# EAGLE design SixPotatoeV5 (EAGLE 9.6.0)
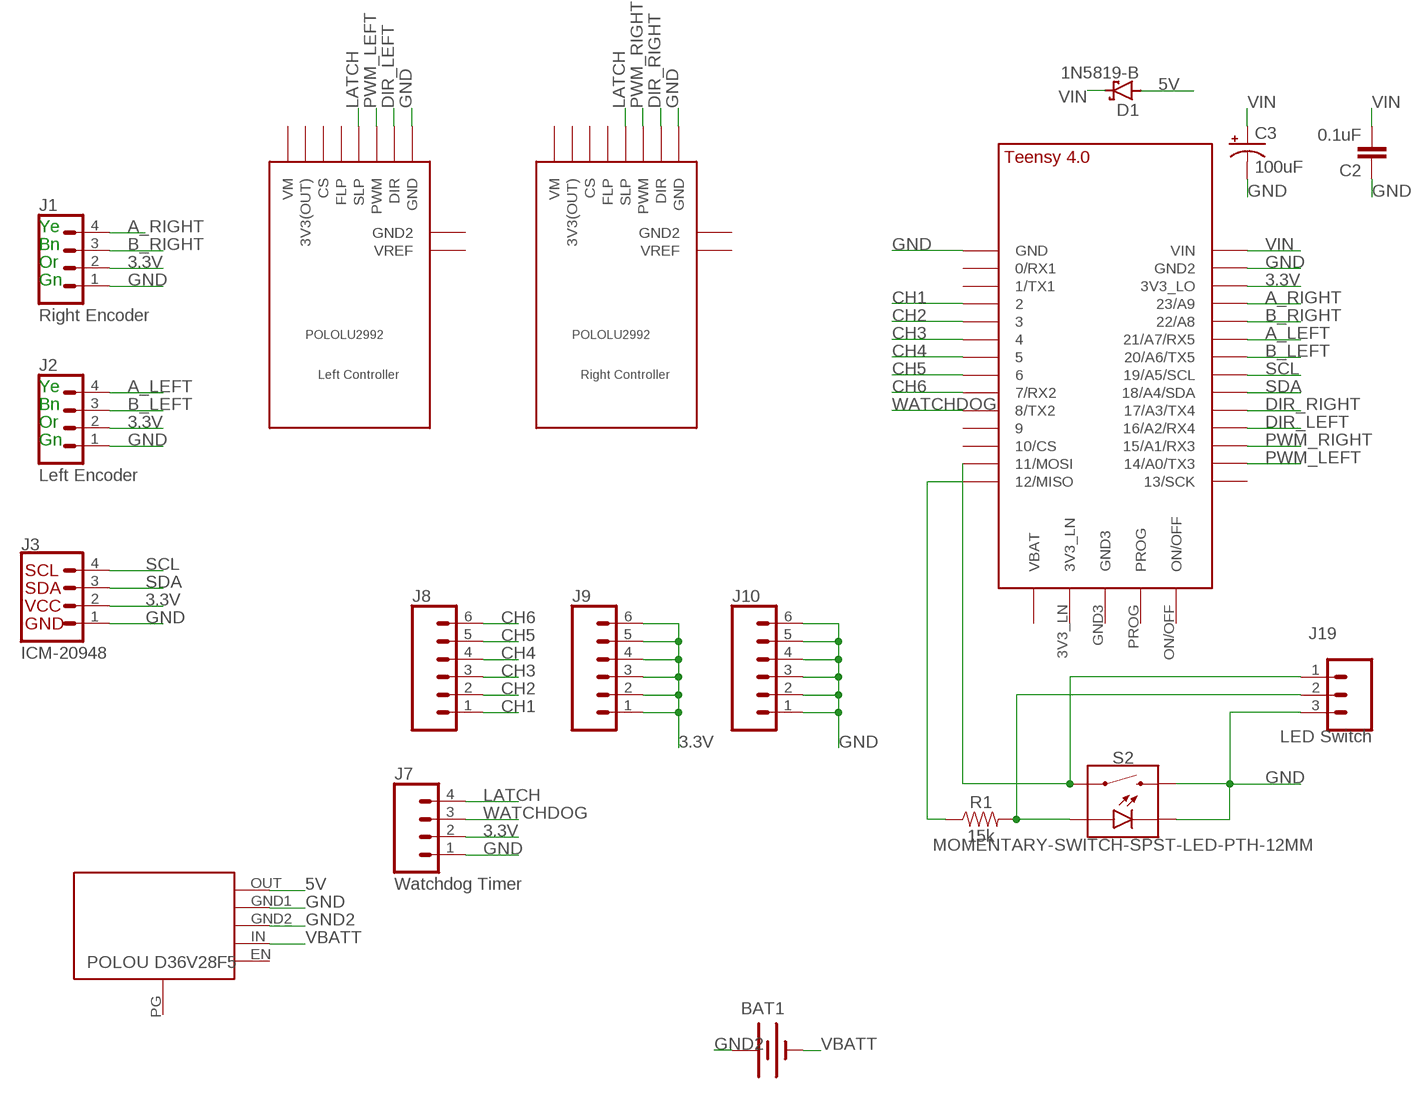
[diagram p0: schematic, sheet 1]

## Parts
BAT1  XT60_MALE  [XT60]
C2  0.1uF  0.1UF-KIT-EZ-50V-20%  [CAP-PTH-SMALL-KIT]
C3  100uF  100UF-POLAR-RADIAL-2.5MM-25V-20%  [CPOL-RADIAL-2.5MM-6.5MM]
D1  1N5819-B  [DO41-7.6]
J1  CONN_04  [1X04]
J2  CONN_04  [1X04]
J3  I2C_STANDARD  [1X04]
J7  CONN_04  [1X04]
J8  CONN_06NO_SILK_FEMALE_PTH  [1X06_NO_SILK]
J9  CONN_06NO_SILK_FEMALE_PTH  [1X06_NO_SILK]
J10  CONN_06NO_SILK_FEMALE_PTH  [1X06_NO_SILK]
J19  CONN_03  [1X03]
R1  15k  15KOHM-HORIZ-1/4W-5%  [AXIAL-0.3]
S2  MOMENTARY-SWITCH-SPST-LED-PTH-12MM  [TACTILE_SWITCH_LED_PTH_12MM]
U$1  TEENSY_4.0  [TEENSY_4.0]
U$2  Left Controller  POLOLU2992_2  [POLOLU2992_2]
U$3  Right Controller  POLOLU2992_2  [POLOLU2992_2]
U$4  POLOU3782  [POLOU3782]

## Nets
3.3V: J1.2 J2.2 J3.2 J7.2 J9.1 J9.2 J9.3 J9.4 J9.5 J9.6 U$1.3V3_LO
5V: D1.A U$4.OUT
A_LEFT: J2.4 U$1.21/A7(21/A7/RX5)
A_RIGHT: J1.4 U$1.23/A9
B_LEFT: J2.3 U$1.20/A6(20/A6/TX5)
B_RIGHT: J1.3 U$1.22/A8
CH1: J8.1 U$1.2
CH2: J8.2 U$1.3/CANTX
CH3: J8.3 U$1.4/CANRX
CH4: J8.4 U$1.5
CH5: J8.5 U$1.6
CH6: J8.6 U$1.7(7/RX2)
DIR_LEFT: U$1.16/A2(16/A2/RX4) U$2.DIR
DIR_RIGHT: U$1.17/A3(17/A3/TX4) U$3.DIR
GND: C2.1 C3.2(-) J1.1 J2.1 J3.1 J7.1 J10.1 J10.2 J10.3 J10.4 J10.5 J10.6 J19.3 S2.2 S2.C U$1.GND U$1.GND2 U$2.GND U$3.GND U$4.GND1
GND2: BAT1.+ U$4.GND2
LATCH: J7.4 U$2.SLP U$3.SLP
N$2: J19.2 R1.P$2 S2.A
N$3: R1.P$1 U$1.12/MISO
N$4: J19.1 S2.4 U$1.11/MOSI
PWM_LEFT: U$1.14/A0(14/A0/TX3) U$2.PWM
PWM_RIGHT: U$1.15/A1(15/A1/RX3) U$3.PWM
SCL: J3.4 U$1.19/A5/SCL
SDA: J3.3 U$1.18/A4/SDA
VBATT: BAT1.- U$4.IN
VIN: C2.2 C3.1(+) D1.C U$1.VIN
WATCHDOG: J7.3 U$1.8(8/TX2)
Unconnected: U$1.0/RX(0/RX1) U$1.1/TX(1/TX1) U$1.3V3_LN U$1.9/CS U$1.10/CS U$1.13/SCK U$1.GND3 U$1.ON/OFF U$1.PROG U$1.VBAT\(VBAT) U$2.3V3(OUT) U$2.CS U$2.FLP U$2.GND2 U$2.VM U$2.VREF U$3.3V3(OUT) U$3.CS U$3.FLP U$3.GND2 U$3.VM U$3.VREF U$4.EN U$4.PG

## Notes on the sheet
- Ye
- Bn
- Or
- Gn
- Ye
- Bn
- Or
- Gn

## Library data of the parts
BAT1 = Tristan+Robitaille's+Library:XT60_MALE: Vertical Mount Through-Hole Male (for female battery) XT60 Connector
C2 = SparkFun-Capacitors:0.1UF: 0.1µF ceramic capacitors A capacitor is a passive two-terminal electrical component used to store electrical energy temporarily in an electric field.; PROD_ID: CAP-08370
C3 = SparkFun-Capacitors:100UF-POLAR: 100µF polarized capacitors A capacitor is a passive two-terminal electrical component used to store electrical energy temporarily in an electric field.; PROD_ID: CAP-08439
D1 = diode:1N581*: 1.0A SCHOTTKY BARRIER RECTIFIER Source: http://www.diodes.com/datasheets/ds23001.pdf
J1 = SparkFun-Connectors:CONN_04: Multi connection point. Often used as Generic Header-pin footprint for 0.1 inch spaced/style header connections On any of the 0.1 inch spaced packages, you can populate with these: Break Away Headers - Straight <https://www.sparkfun.com/products/116> (PRT-00116) Break Away Male Headers - Right Angle <https://www.sparkfun.com/products/553> (PRT-00553) Female Headers <https://www.sparkfun.com/products/115> (PRT-00115) Break Away Headers - Machine Pin <https://www.sparkfun.com/products/117> (PRT-00117) Break Away Female Headers - Swiss Machine Pin <https://www.sparkfun.com/products/743> (PRT-00743) For SCREWTERMINALS and SPRING TERMINALS visit here: Screw Terimnals on SparkFun.com <https://www.sparkfun.com/search/results?term=Screw+Terminals> (5mm/3.5mm/2.54mm spacing) This device is also useful as a general connection point to wire up your design to another part of your project. Our various solder wires solder well into these plated through hole pads. Hook-Up Wire - Assortment (Stranded, 22 AWG) <https://www.sparkfun.com/products/11375> (PRT-11375) Hook-Up Wire - Assortment (Solid Core, 22 AWG) <https://www.sparkfun.com/products/11367> (PRT-11367) View the entire wire category on our website here <https://www.sparkfun.com/categories/141> Special notes: Molex polarized connector foot print use with SKU : PRT-08231 with associated crimp pins and housings. 1MM SMD Version SKU: PRT-10208; ID: Right Encoder; PROD_ID: CONN-09696
J2 = SparkFun-Connectors:CONN_04: Multi connection point. Often used as Generic Header-pin footprint for 0.1 inch spaced/style header connections On any of the 0.1 inch spaced packages, you can populate with these: Break Away Headers - Straight <https://www.sparkfun.com/products/116> (PRT-00116) Break Away Male Headers - Right Angle <https://www.sparkfun.com/products/553> (PRT-00553) Female Headers <https://www.sparkfun.com/products/115> (PRT-00115) Break Away Headers - Machine Pin <https://www.sparkfun.com/products/117> (PRT-00117) Break Away Female Headers - Swiss Machine Pin <https://www.sparkfun.com/products/743> (PRT-00743) For SCREWTERMINALS and SPRING TERMINALS visit here: Screw Terimnals on SparkFun.com <https://www.sparkfun.com/search/results?term=Screw+Terminals> (5mm/3.5mm/2.54mm spacing) This device is also useful as a general connection point to wire up your design to another part of your project. Our various solder wires solder well into these plated through hole pads. Hook-Up Wire - Assortment (Stranded, 22 AWG) <https://www.sparkfun.com/products/11375> (PRT-11375) Hook-Up Wire - Assortment (Solid Core, 22 AWG) <https://www.sparkfun.com/products/11367> (PRT-11367) View the entire wire category on our website here <https://www.sparkfun.com/categories/141> Special notes: Molex polarized connector foot print use with SKU : PRT-08231 with associated crimp pins and housings. 1MM SMD Version SKU: PRT-10208; ID: Left Encoder; PROD_ID: CONN-09696
J3 = SparkFun-Connectors:I2C_STANDARD: SparkFun I2C Standard Pinout Header SparkFun has standardized on a pinout for all I2C based sensor breakouts. This pinout allows I2C boards to be plugged directly into the headers on Arduino Uno compatible boards, and to be daisy chained easily. Example SparkFun Products: SparkFun Atmospheric Sensor Breakout - BME280 <https://www.sparkfun.com/products/13676> SparkFun Altitude/Pressure Sensor Breakout - MPL3115A2 <https://www.sparkfun.com/products/11084> SparkFun TOF Range Finder Sensor - VL6180 <https://www.sparkfun.com/products/12785>; ID: ICM-20948
J7 = SparkFun-Connectors:CONN_04: Multi connection point. Often used as Generic Header-pin footprint for 0.1 inch spaced/style header connections On any of the 0.1 inch spaced packages, you can populate with these: Break Away Headers - Straight <https://www.sparkfun.com/products/116> (PRT-00116) Break Away Male Headers - Right Angle <https://www.sparkfun.com/products/553> (PRT-00553) Female Headers <https://www.sparkfun.com/products/115> (PRT-00115) Break Away Headers - Machine Pin <https://www.sparkfun.com/products/117> (PRT-00117) Break Away Female Headers - Swiss Machine Pin <https://www.sparkfun.com/products/743> (PRT-00743) For SCREWTERMINALS and SPRING TERMINALS visit here: Screw Terimnals on SparkFun.com <https://www.sparkfun.com/search/results?term=Screw+Terminals> (5mm/3.5mm/2.54mm spacing) This device is also useful as a general connection point to wire up your design to another part of your project. Our various solder wires solder well into these plated through hole pads. Hook-Up Wire - Assortment (Stranded, 22 AWG) <https://www.sparkfun.com/products/11375> (PRT-11375) Hook-Up Wire - Assortment (Solid Core, 22 AWG) <https://www.sparkfun.com/products/11367> (PRT-11367) View the entire wire category on our website here <https://www.sparkfun.com/categories/141> Special notes: Molex polarized connector foot print use with SKU : PRT-08231 with associated crimp pins and housings. 1MM SMD Version SKU: PRT-10208; ID: Watchdog Timer; PROD_ID: CONN-09696
J8-J10 = SparkFun-Connectors:CONN_06: Multi connection point. Often used as Generic Header-pin footprint for 0.1 inch spaced/style header connections On any of the 0.1 inch spaced packages, you can populate with these: Break Away Headers - Straight <https://www.sparkfun.com/products/116> (PRT-00116) Break Away Male Headers - Right Angle <https://www.sparkfun.com/products/553> (PRT-00553) Female Headers <https://www.sparkfun.com/products/115> (PRT-00115) Break Away Headers - Machine Pin <https://www.sparkfun.com/products/117> (PRT-00117) Break Away Female Headers - Swiss Machine Pin <https://www.sparkfun.com/products/743> (PRT-00743) Arduino Stackable Header - 6 Pin <https://www.sparkfun.com/products/9280> (PRT-09280) For SCREWTERMINALS and SPRING TERMINALS visit here: Screw Terimnals on SparkFun.com <https://www.sparkfun.com/search/results?term=Screw+Terminals> (5mm/3.5mm/2.54mm spacing) This device is also useful as a general connection point to wire up your design to another part of your project. Our various solder wires solder well into these plated through hole pads. Hook-Up Wire - Assortment (Stranded, 22 AWG) <https://www.sparkfun.com/products/11375> (PRT-11375) Hook-Up Wire - Assortment (Solid Core, 22 AWG) <https://www.sparkfun.com/products/11367> (PRT-11367) View the entire wire category on our website here <https://www.sparkfun.com/categories/141>; PROD_ID: CONN-08437
J19 = SparkFun-Connectors:CONN_03: Multi connection point. Often used as Generic Header-pin footprint for 0.1 inch spaced/style header connections On any of the 0.1 inch spaced packages, you can populate with these: Break Away Headers - Straight <https://www.sparkfun.com/products/116> (PRT-00116) Break Away Male Headers - Right Angle <https://www.sparkfun.com/products/553> (PRT-00553) Female Headers <https://www.sparkfun.com/products/115> (PRT-00115) Break Away Headers - Machine Pin <https://www.sparkfun.com/products/117> (PRT-00117) Break Away Female Headers - Swiss Machine Pin <https://www.sparkfun.com/products/743> (PRT-00743) Stackable Header - 3 Pin (Female, 0.1") <https://www.sparkfun.com/products/13875> (PRT-13875) For SCREWTERMINALS and SPRING TERMINALS visit here: Screw Terimnals on SparkFun.com <https://www.sparkfun.com/search/results?term=Screw+Terminals> (5mm/3.5mm/2.54mm spacing) This device is also useful as a general connection point to wire up your design to another part of your project. Our various solder wires solder well into these plated through hole pads. Hook-Up Wire - Assortment (Stranded, 22 AWG) <https://www.sparkfun.com/products/11375> (PRT-11375) Hook-Up Wire - Assortment (Solid Core, 22 AWG) <https://www.sparkfun.com/products/11367> (PRT-11367) View the entire wire category on our website here <https://www.sparkfun.com/categories/141> Special notes: Molex polarized connector foot print use with SKU : PRT-08232 with associated crimp pins and housings.; ID: LED Switch
R1 = SparkFun-Resistors:15KOHM: 15kΩ resistor A resistor is a passive two-terminal electrical component that implements electrical resistance as a circuit element. Resistors act to reduce current flow, and, at the same time, act to lower voltage levels within circuits. - Wikipedia; PROD_ID: RES-11360
S2 = TimEagleLibrary:MOMENTARY-SWITCH-SPST-LED: Momentary Switch (Pushbutton) - SPST - w/ LED Normally-open (NO) SPST momentary switches (buttons, pushbuttons), with a built-in LED. Variants PTH-CHERRY - Cherry MX Switch Cherry MX Keyswitches are top-of-the-line mechanical keyboard switches. They’re satisfyingly “clicky”, reliable up to tens-of-millions of key presses, and a standard in gaming and programming keyboards across the globe. This ‘blue’ version Cherry MX Switch is favored by most due to its secondary internal actuator making it less likely to “double-tap.” If you are looking for a noticeably audible and high-quality key switch, this is the perfect option for you! Cherry MX Switch <https://www.sparkfun.com/products/13834> (COM-13834) Cherry MX Switch Breakout <https://www.sparkfun.com/products/13773> (BOB-13773) PTH-12MM and PTH-12MM-KIT - 12mm Illuminated LED KIT variant is for soldering kits. There is no tStop (covering up the top side of the pads with mask). This helps the beginner see which side they should be soldering too. LED Tactile Button Breakout <https://www.sparkfun.com/products/10467> (BOB-10467) LED Tactile Button - Red <https://www.sparkfun.com/products/10442> (COM-10442) LED Tactile Button - Blue <https://www.sparkfun.com/products/10443> (COM-10443) LED Tactile Button - Green <https://www.sparkfun.com/products/10440> (COM-10440) LED Tactile Button - Orange <https://www.sparkfun.com/products/10441> (COM-10441) LED Tactile Button - White <https://www.sparkfun.com/products/10439> (COM-10439); PROD_ID: SWCH-11758; SF_SKU: COM-10442
U$1 = TEENSY 4.0:TEENSY_4.0
U$2 U$3 = TimEagleLibrary:POLOLU2992_2
U$4 = TimEagleLibrary:POLOU3782

## Board
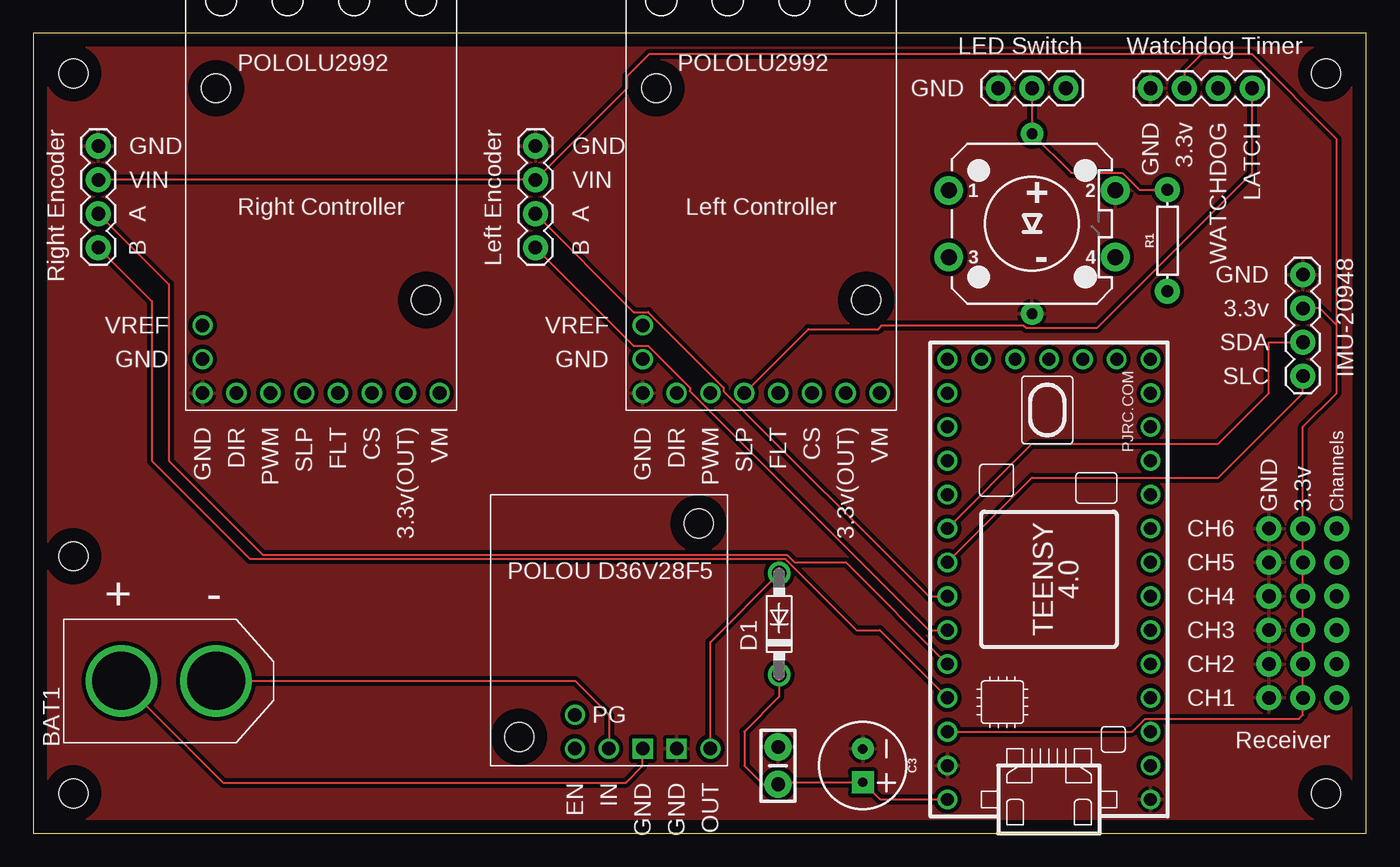
[diagram p1: board, top side]
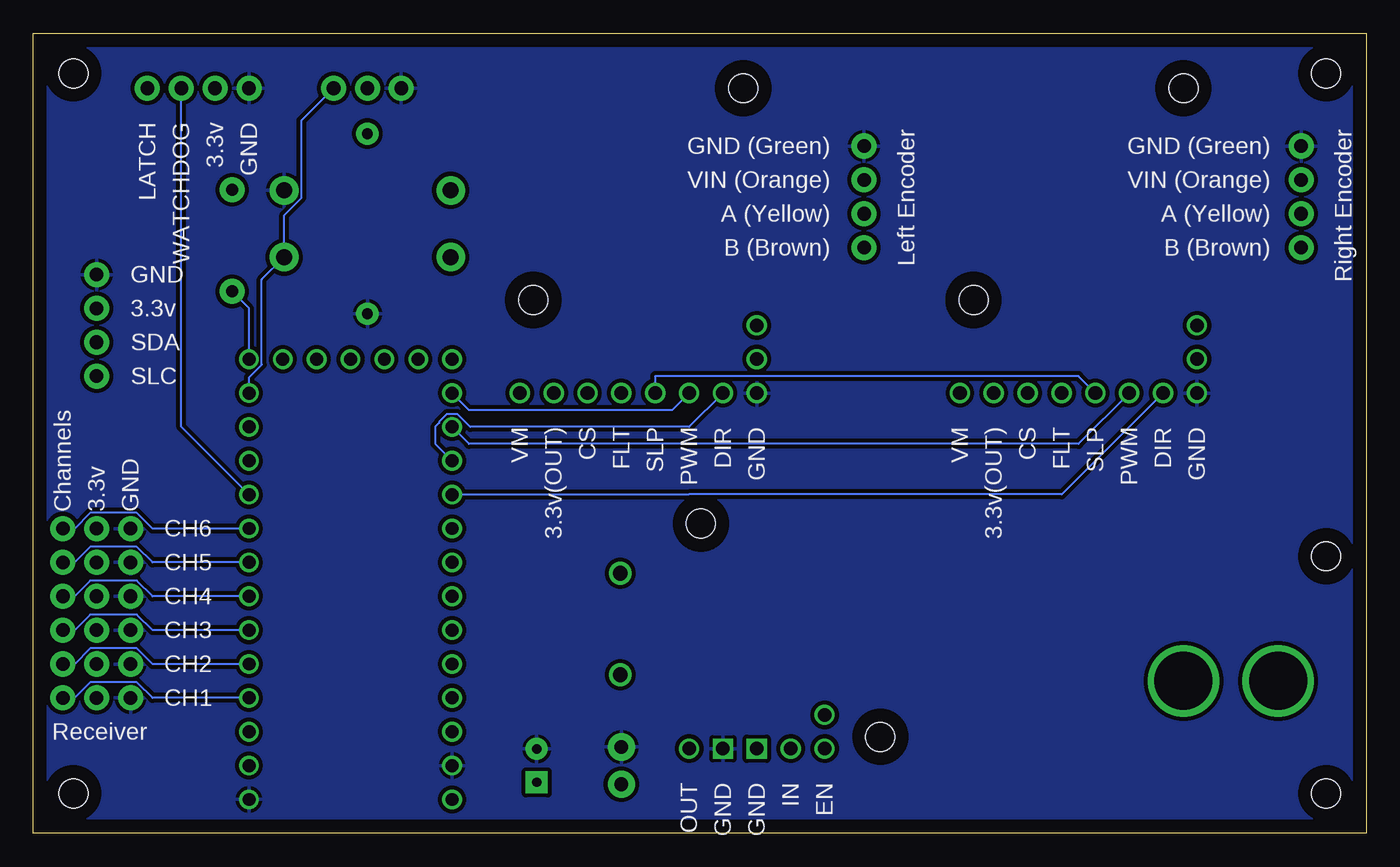
[diagram p2: board, bottom side, seen from below]

Size 100 x 60 mm. Coordinates in mm from the lower left corner, seen from the top.
Outline: 0,0 100,0 100,60 0,60 0,0
Copper layers (1*16): Top 0.035mm / dielectric 1.5mm / Bottom 0.035mm
Design rules "default": minimum track width 6mil, minimum drill 0.35mm, track to track 6mil, track to pad 6mil, pad to pad 6mil, via to via 6mil, smd to smd 6mil, copper to edge 40mil, drill to drill 6mil, minimum pad ring 10mil, minimum via ring 8mil, stop-mask expansion 4mil, vias tented up to drill 0mil, thermal gap 10mil
Holes 2.18 mm at 97,57 97,3 3,3 3,57 3,20.78

### Footprints (pad centres in the part's own frame; a part is rotated, then mirrored left to right if it is on the bottom)
XT60 = drill 4.35: + 3.55,0; - -3.55,0
CAP-PTH-SMALL-KIT = drill 1.016 pad 2.032: 1 -1.397,0; 2 1.397,0
CPOL-RADIAL-2.5MM-6.5MM = drill 0.7 pad 1.651 square: 1 1.25,0 | drill 0.7 pad 1.651: 2 -1.25,0
DO41-7.6 = drill 1.1 pad 1.7: A 3.81,0; C -3.81,0
1X04 = drill 1.016 pad 1.88: 1 0,0; 2 2.54,0; 3 5.08,0; 4 7.62,0
1X06_NO_SILK = drill 1.016 pad 1.88: 1 0,0; 2 2.54,0; 3 5.08,0; 4 7.62,0; 5 10.16,0; 6 12.7,0
1X03 = drill 1.016 pad 1.88: 1 0,0; 2 2.54,0; 3 5.08,0
AXIAL-0.3 = drill 0.9 pad 1.88: P$1 -3.81,0; P$2 3.81,0
TACTILE_SWITCH_LED_PTH_12MM = drill 1.2 pad 2.159: 1 -6.25,2.5; 2 6.25,2.5; 3 -6.25,-2.5; 4 6.25,-2.5 | drill 0.8 pad 1.676: A 0,6.75; C 0,-6.75
TEENSY_4.0 = drill 0.965: 0/RX -13.97,-7.62; 1/TX -11.43,-7.62; 2 -8.89,-7.62; 3/CANTX -6.35,-7.62; 3V3_LN 16.51,-2.54; 3V3_LO -11.43,7.62; 4/CANRX -3.81,-7.62; 5 -1.27,-7.62; 6 1.27,-7.62; 7 3.81,-7.62; 8 6.35,-7.62; 9/CS 8.89,-7.62; 10/CS 11.43,-7.62; 11/MOSI 13.97,-7.62; 12/MISO 16.51,-7.62; 13/SCK 16.51,7.62; 14/A0 13.97,7.62; 15/A1 11.43,7.62; 16/A2 8.89,7.62; 17/A3 6.35,7.62; 18/A4/SDA 3.81,7.62; 19/A5/SCL 1.27,7.62; 20/A6 -1.27,7.62; 21/A7 -3.81,7.62; 22/A8 -6.35,7.62; 23/A9 -8.89,7.62; GND -16.51,-7.62; GND2 -13.97,7.62; GND3 16.51,0; ON/OFF 16.51,5.08; PROG 16.51,2.54; VBAT\ 16.51,-5.08; VIN -16.51,7.62
POLOLU2992_2 = drill 1.016: 3V3(OUT) 3.81,31.75; CS 6.35,31.75; DIR 16.51,31.75; FLP 8.89,31.75; GND 19.05,31.75; GND2 19.05,29.21; PWM 13.97,31.75; SLP 11.43,31.75; VM 1.27,31.75; VREF 19.05,26.67 | hole 2.184: 2.286,24.765; 18.034,8.89
POLOU3782 = drill 1.016: EN -2.54,-7.62; IN 0,-7.62; OUT 7.62,-7.62; PG -2.54,-5.08 | drill 1.016 square: GND1 5.08,-7.62; GND2 2.54,-7.62 | hole 2.184: -6.731,-6.731; 6.731,9.271

### Placement (x,y rotation side)
BAT1  10.16,11.43 180 top
C2  55.88,5.08 270 top
C3  62.23,5.08 270 top
D1  55.96,15.7 90 top
J1  4.88,51.55 270 top
J2  37.67,51.55 270 top
J3  95.25,41.91 270 top
J7  83.82,55.88 0 top
J8  97.79,10.16 90 top
J9  95.25,10.16 90 top
J10  92.71,10.16 90 top
J19  77.47,55.88 180 top
R1  85.09,44.45 90 top
S2  74.93,45.72 0 top
U$1  76.2,19.05 90 top
U$2  64.77,64.77 180 top
U$3  31.75,64.77 180 top
U$4  43.18,13.97 0 top

### Tracks (layer width: path | path; a pad name or v marks a point on that pad's centre or on a via)
3.3V
  Top 0.152: U$1.3V3_LO 82.45,7.62 83.42,8.59 94.94,8.59 95.25,8.89 J9.1 J9.2 J9.3 J9.4 J9.5 J9.6 95.25,30.48 97.79,33.02 97.79,38.1 | 97.79,38.1 96.52,39.37 J3.2 | 97.79,38.1 97.79,52.07 91.44,58.42 87.63,58.42 | 87.63,58.42 86.36,57.15 J7.2 | 87.63,58.42 46.19,58.42 44.55,56.78 44.55,55.89 J2.2 J1.2
5V
  Top 0.152: U$4.OUT 50.8,14.35 D1.A
A_LEFT
  Top 0.152: J2.4 45.05,36.55 46.13,36.55 49.25,33.43 49.25,33.17 67.18,15.24 U$1.21/A7
A_RIGHT
  Top 0.152: J1.4 8.89,39.92 8.89,27.94 16.24,20.59 56.41,20.59 61.76,15.24 63.5,15.24 U$1.23/A9
B_LEFT
  Top 0.152: J2.3 45.05,39.09 46.13,39.09 51.79,33.43 51.79,33.17 67.18,17.78 U$1.20/A6
B_RIGHT
  Top 0.152: J1.3 10.16,41.19 10.16,27.94 17.21,20.89 56.53,20.89 57.11,20.32 60.96,20.32 U$1.22/A8
CH1
  Bottom 0.152: U$1.2 91.06,10.16 92.23,11.33 95.73,11.33 96.9,10.16 J8.1
CH2
  Bottom 0.152: U$1.3/CANTX 91.06,12.7 92.23,13.87 95.73,13.87 96.9,12.7 J8.2
CH3
  Bottom 0.152: U$1.4/CANRX 91.06,15.24 92.23,16.41 95.73,16.41 96.9,15.24 J8.3
CH4
  Bottom 0.152: U$1.5 91.06,17.78 92.23,18.95 95.73,18.95 96.9,17.78 J8.4
CH5
  Bottom 0.152: U$1.6 91.06,20.32 92.23,21.49 95.73,21.49 96.9,20.32 J8.5
CH6
  Bottom 0.152: U$1.7 91.06,22.86 92.23,24.03 95.73,24.03 96.9,22.86 J8.6
DIR_LEFT
  Bottom 0.152: U$2.DIR 50.8,30.48 67.22,30.48 68.18,31.45 68.98,31.45 69.55,30.88 69.55,30.79 69.85,30.48 69.85,29.21 U$1.16/A2
DIR_RIGHT
  Bottom 0.152: U$1.17/A3 50.84,25.4 50.82,25.43 22.84,25.43 U$3.DIR
GND
  pour Top (isolate 0.305): 0,0 100,0 100,60 0,60
  pour Bottom (isolate 0.305): 0,0 100,0 100,60 0,60
GND2
  Top 0.152: BAT1.+ 14.23,3.81 44.45,3.81 45.72,5.08 U$4.GND2
LATCH
  Top 0.152: U$2.SLP 58.14,37.82 63.39,37.82 63.67,38.1 74.29,38.1 74.49,37.9 79.81,37.9 91.44,49.53 J7.4
  Bottom 0.152: U$3.SLP 21.59,34.29 53.34,34.29 U$2.SLP
N$2
  Top 0.152: J19.2 S2.A 77.87,49.53 81.72,49.53 82.99,48.26 R1.P$2
N$3
  Bottom 0.152: U$1.12/MISO 83.82,39.37 R1.P$1
N$4
  Bottom 0.152: U$1.11/MOSI 83.82,34.2 82.86,35.16 82.86,41.55 S2.4 81.18,46.37 79.87,47.68 79.87,53.48 J19.1
PWM_LEFT
  Bottom 0.152: U$2.PWM 52.07,31.75 67.31,31.75 U$1.14/A0
PWM_RIGHT
  Bottom 0.152: U$3.PWM 21.59,29.21 67.31,29.21 U$1.15/A1
SCL
  Top 0.152: U$1.19/A5/SCL 74.93,26.67 88.9,26.67 95.25,33.02 J3.4
SDA
  Top 0.152: U$1.18/A4/SDA 74.93,29.21 88.9,29.21 92.71,33.02 92.71,36.83 J3.3
VBATT
  Top 0.152: BAT1.- 40.64,11.43 43.18,8.89 U$4.IN
VIN
  Top 0.152: D1.C 55.96,10.24 53.34,7.62 53.34,5.08 54.74,3.68 C2.2 56.03,3.83 C3.1 63.52,2.54 U$1.VIN
WATCHDOG
  Bottom 0.152: U$1.8 88.9,30.48 J7.3

### Text on the board
tPlace: LED Switch | Watchdog Timer | GND | Right Encoder | Left Encoder | GND | 3.3v | WATCHDOG | LATCH | GND | GND | VIN | VIN | A | A | B | B | IMU-20948 | GND | 3.3v | SDA | SLC | GND | 3.3v | Channels | CH6 | CH5 | CH4 | CH3 | CH2 | CH1 | PG | Receiver | EN | IN | GND | GND | OUT
bPlace: Right Encoder | Left Encoder | GND | 3.3v | WATCHDOG | LATCH | GND (Green) | GND (Green) | VIN (Orange) | VIN (Orange) | A (Yellow) | A (Yellow) | B (Brown) | B (Brown) | GND | 3.3v | SDA | SLC | GND | DIR | PWM | SLP | FLT | CS | 3.3v(OUT) | VM | GND | DIR | PWM | SLP | FLT | CS | 3.3v(OUT) | VM | GND | 3.3v | Channels | CH6 | CH5 | CH4 | CH3 | CH2 | CH1 | Receiver | EN | IN | GND | GND | OUT